# Altium schematic sheet SH24 - ENET PHY.SchDoc
size 386 x 246 mm
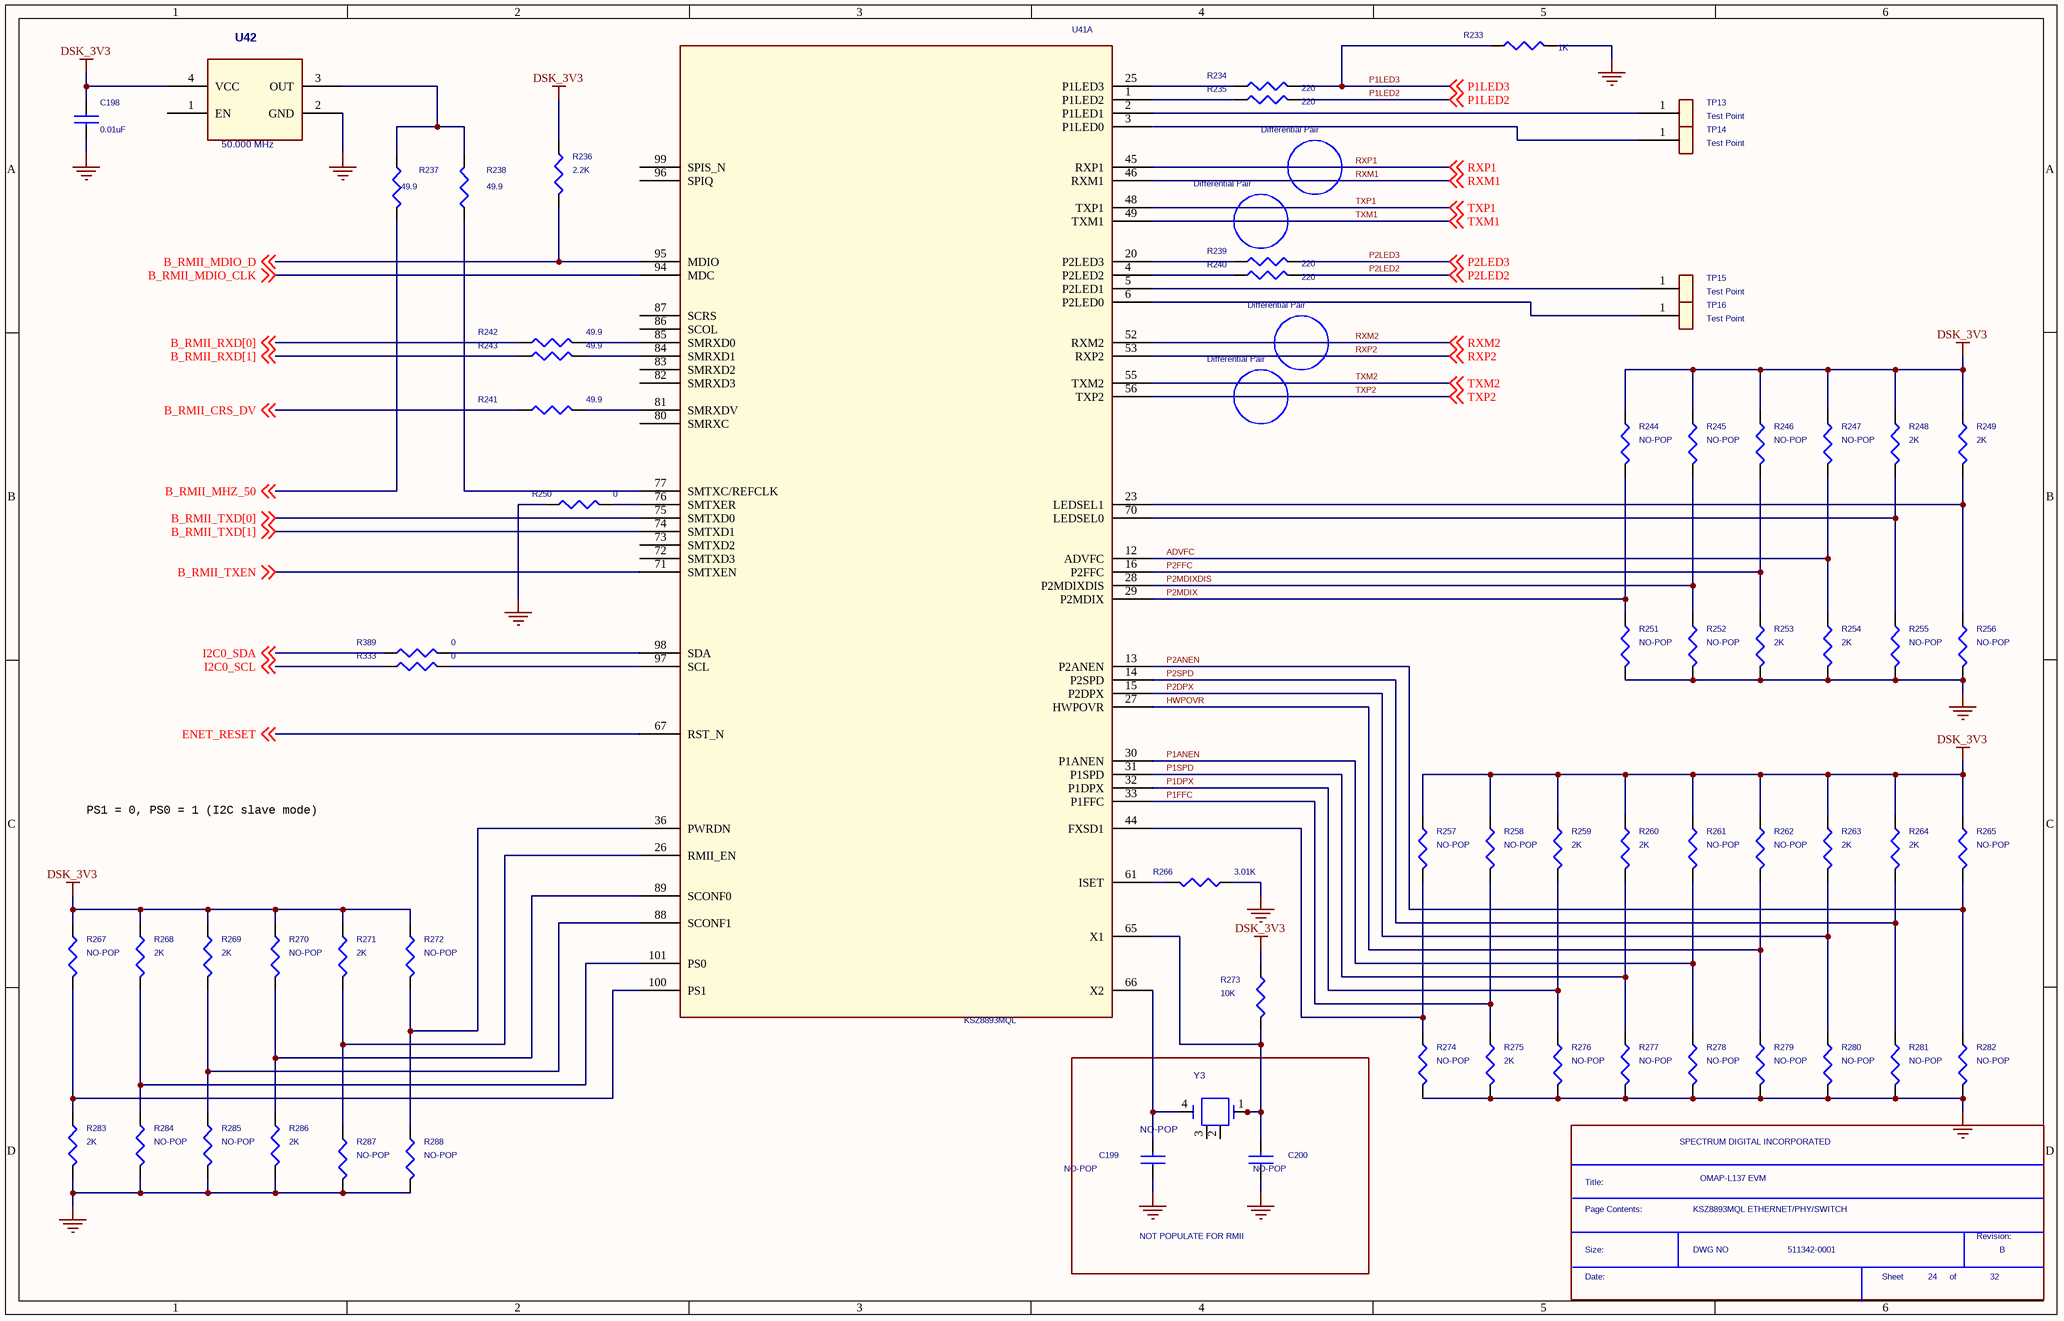
[diagram p0: SH24 - ENET PHY.SchDoc]

## Parts
*  Page Contents:: KSZ8893MQL ETHERNET/PHY/SWITCH  RevCode: B  Title: OMAP-L137 EVM  OrgName: SPECTRUM DIGITAL INCORPORATED  Doc: 511342-0001  Page Number: 24  Page Count: 32  (hidden comment: SDTitleBlock)  (graphical)
C198  0.01uF  [c402-25]
C199  NO-POP  [c603-35x45]
C200  NO-POP  [c603-35x45]
R233  1K  [r402-25]
R234  220  [r402-25]
R235  220  [r402-25]
R236  2.2K  [r402-25]
R237  49.9  [r603-35x45]
R238  49.9  [r603-35x45]
R239  220  [r402-25]
R240  220  [r402-25]
R241  49.9  [r603-35x45]
R242  49.9  [r603-35x45]
R243  49.9  [r603-35x45]
R244  NO-POP  [r402-25]
R245  NO-POP  [r402-25]
R246  NO-POP  [r402-25]
R247  NO-POP  [r402-25]
R248  2K  [r402-25]
R249  2K  [r402-25]
R250  0  [r402-25]
R251  NO-POP  [r402-25]
R252  NO-POP  [r402-25]
R253  2K  [r402-25]
R254  2K  [r402-25]
R255  NO-POP  [r402-25]
R256  NO-POP  [r402-25]
R257  NO-POP  [r402-25]
R258  NO-POP  [r402-25]
R259  2K  [r402-25]
R260  2K  [r402-25]
R261  NO-POP  [r402-25]
R262  NO-POP  [r402-25]
R263  2K  [r402-25]
R264  2K  [r402-25]
R265  NO-POP  [r402-25]
R266  3.01K  [r603-35x45]
R267  NO-POP  [r402-25]
R268  2K  [r402-25]
R269  2K  [r402-25]
R270  NO-POP  [r402-25]
R271  2K  [r402-25]
R272  NO-POP  [r402-25]
R273  10K  [r402-25]
R274  NO-POP  [r402-25]
R275  2K  [r402-25]
R276  NO-POP  [r402-25]
R277  NO-POP  [r402-25]
R278  NO-POP  [r402-25]
R279  NO-POP  [r402-25]
R280  NO-POP  [r402-25]
R281  NO-POP  [r402-25]
R282  NO-POP  [r402-25]
R283  2K  [r402-25]
R284  NO-POP  [r402-25]
R285  NO-POP  [r402-25]
R286  2K  [r402-25]
R287  NO-POP  [r402-25]
R288  NO-POP  [r402-25]
R333  0  [r402-25]
R389  0  [r402-25]
TP13  Test Point  [tp1-6040]
TP14  Test Point  [tp1-6040]
TP15  Test Point  [tp1-6040]
TP16  Test Point  [tp1-6040]
U41  KSZ8893MQL  [pqfp128rec-12x70]  (part A of 2)
U42  50.000 MHz  [OSC4-71X79]
Y3  NO-POP  [xtal2-75x94]

## Blocks framed on the sheet
NOT POPULATE FOR RMII: C199 C200 Y3

## Nets
DSK_3V3: C198.1 R236.1 R244.1 R245.1 R246.1 R247.1 R248.1 R249.1 R257.1 R258.1 R259.1 R260.1 R261.1 R262.1 R263.1 R264.1 R265.1 R267.1 R268.1 R269.1 R270.1 R271.1 R272.1 R273.1 U42.4(VCC)
GND: C198.2 C199.1 C200.1 R233.1 R250.1 R251.2 R252.2 R253.2 R254.2 R255.2 R256.2 R266.1 R274.2 R275.2 R276.2 R277.2 R278.2 R279.2 R280.2 R281.2 R282.2 R283.2 R284.2 R285.2 R286.2 R287.2 R288.2 U42.2(GND)
ADVFC: R247.2 R254.1 U41.12(ADVFC)
B_RMII_CRS_DV: R241.1 ; off-sheet B_RMII_CRS_DV
B_RMII_MDIO_CLK: U41.94(MDC) ; off-sheet B_RMII_MDIO_CLK
B_RMII_MDIO_D: R236.2 U41.95(MDIO) ; off-sheet B_RMII_MDIO_D
B_RMII_MHZ_50: R237.1 ; off-sheet B_RMII_MHZ_50
B_RMII_RXD[0]: R242.1 ; off-sheet B_RMII_RXD[0]
B_RMII_RXD[1]: R243.1 ; off-sheet B_RMII_RXD[1]
B_RMII_TXD[0]: U41.75(SMTXD0) ; off-sheet B_RMII_TXD[0]
B_RMII_TXD[1]: U41.74(SMTXD1) ; off-sheet B_RMII_TXD[1]
B_RMII_TXEN: U41.71(SMTXEN) ; off-sheet B_RMII_TXEN
ENET_RESET: U41.67(RST_N) ; off-sheet ENET_RESET
HWPOVR: R262.2 R279.1 U41.27(HWPOVR)
I2C0_SCL: R333.1 ; off-sheet I2C0_SCL
I2C0_SDA: R389.1 ; off-sheet I2C0_SDA
P1ANEN: R261.2 R278.1 U41.30(P1ANEN)
P1DPX: R259.2 R276.1 U41.32(P1DPX)
P1FFC: R258.2 R275.1 U41.33(P1FFC)
P1LED2: R235.1 ; off-sheet P1LED2
P1LED3: R233.2 R234.1 ; off-sheet P1LED3
P1SPD: R260.2 R277.1 U41.31(P1SPD)
P2ANEN: R265.2 R282.1 U41.13(P2ANEN)
P2DPX: R263.2 R280.1 U41.15(P2DPX)
P2FFC: R246.2 R253.1 U41.16(P2FFC)
P2LED2: R240.1 ; off-sheet P2LED2
P2LED3: R239.1 ; off-sheet P2LED3
P2MDIX: R244.2 R251.1 U41.29(P2MDIX)
P2MDIXDIS: R245.2 R252.1 U41.28(P2MDIXDIS)
P2SPD: R264.2 R281.1 U41.14(P2SPD)
RXM1: U41.46(RXM1) ; off-sheet RXM1
RXM2: U41.52(RXM2) ; off-sheet RXM2
RXP1: U41.45(RXP1) ; off-sheet RXP1
RXP2: U41.53(RXP2) ; off-sheet RXP2
TXM1: U41.49(TXM1) ; off-sheet TXM1
TXM2: U41.55(TXM2) ; off-sheet TXM2
TXP1: U41.48(TXP1) ; off-sheet TXP1
TXP2: U41.56(TXP2) ; off-sheet TXP2
NetC199_2: C199.2 U41.66(X2) Y3.4
NetC200_2: C200.2 R273.2 U41.65(X1) Y3.1
NetR234_2: R234.2 U41.25(P1LED3)
NetR235_2: R235.2 U41.1(P1LED2)
NetR237_2: R237.2 R238.2 U42.3(OUT)
NetR238_1: R238.1 U41.77(SMTXC/REFCLK)
NetR239_2: R239.2 U41.20(P2LED3)
NetR240_2: R240.2 U41.4(P2LED2)
NetR241_2: R241.2 U41.81(SMRXDV)
NetR242_2: R242.2 U41.85(SMRXD0)
NetR243_2: R243.2 U41.84(SMRXD1)
NetR248_2: R248.2 R255.1 U41.70(LEDSEL0)
NetR249_2: R249.2 R256.1 U41.23(LEDSEL1)
NetR250_2: R250.2 U41.76(SMTXER)
NetR257_2: R257.2 R274.1 U41.44(FXSD1)
NetR266_2: R266.2 U41.61(ISET)
NetR267_2: R267.2 R283.1 U41.100(PS1)
NetR268_2: R268.2 R284.1 U41.101(PS0)
NetR269_2: R269.2 R285.1 U41.88(SCONF1)
NetR270_2: R270.2 R286.1 U41.89(SCONF0)
NetR271_2: R271.2 R287.1 U41.26(RMII_EN)
NetR272_2: R272.2 R288.1 U41.36(PWRDN)
NetR333_2: R333.2 U41.97(SCL)
NetR389_2: R389.2 U41.98(SDA)
NetTP13_1: TP13.1 U41.2(P1LED1)
NetTP14_1: TP14.1 U41.3(P1LED0)
NetTP15_1: TP15.1 U41.5(P2LED1)
NetTP16_1: TP16.1 U41.6(P2LED0)

Not connected (* = marked no-connect by the designer): U41 72(SMTXD3) 73(SMTXD2) 80(SMRXC) 82(SMRXD3) 83(SMRXD2) 86(SCOL) 87(SCRS) 96(SPIQ) 99(SPIS_N); U42 1(EN); Y3 2 3

## Notes on the sheet
- Differential Pair
- PS1 = 0, PS0 = 1 (I2C slave mode)
- (in symbol SDTitleBlock) Title:; Page Contents:; Revision:; Size:; DWG NO; Date:; Sheet; of

## Library data of the parts
C198 = CAP NP: Part #: 101587-1101R
C199 C200 = CAP NP: Part # Alt: 101002-1224R; Part #: C0603-NOPOP
R233 = RESISTOR_0: Part #: 101370-1002R
R234 R235 R239 R240 = RESISTOR_0: Part #: 101370-2201R
R236 = RESISTOR_0: Part #: 101370-2202R
R237 R238 = RESISTOR_0: Part #: 100642-4990R
R241-R243 = R: Part #: 100642-4990R
R244-R247 R251 R252 R255-R258 R261 R262 R265 R267 R270 R272 R274 R276-R282 R284 R285 R287 R288 = RESISTOR_0: Part #: R0402-NOPOP
R248 R249 R253 R254 R259 R260 R263 R264 R268 R269 R271 R275 R283 R286 = RESISTOR_0: Part #: 101370-2002R
R250 = RESISTOR_0: Part #: 101370-0001R
R266 = RESISTOR_0: Part #: 100642-3012R
R273 = RESISTOR_0: Part #: 101370-1003R
R333 R389 = R: Part #: 101370-0001R
TP13-TP16 = TEST POINT: Part #: 100115-0001R
U41 = KS8995_multi_0: Part #: 102795-0001R
U42 = OSC_0: Part Number: OSC-66M-01; Part #: 100983-0050R; Part Type: Oscillator
Y3 = CRYSTAL_0: Part # Alt: 101590-0250R; Part #: NO-POP